# Altium schematic sheet 外围接口.SchDoc
size A4
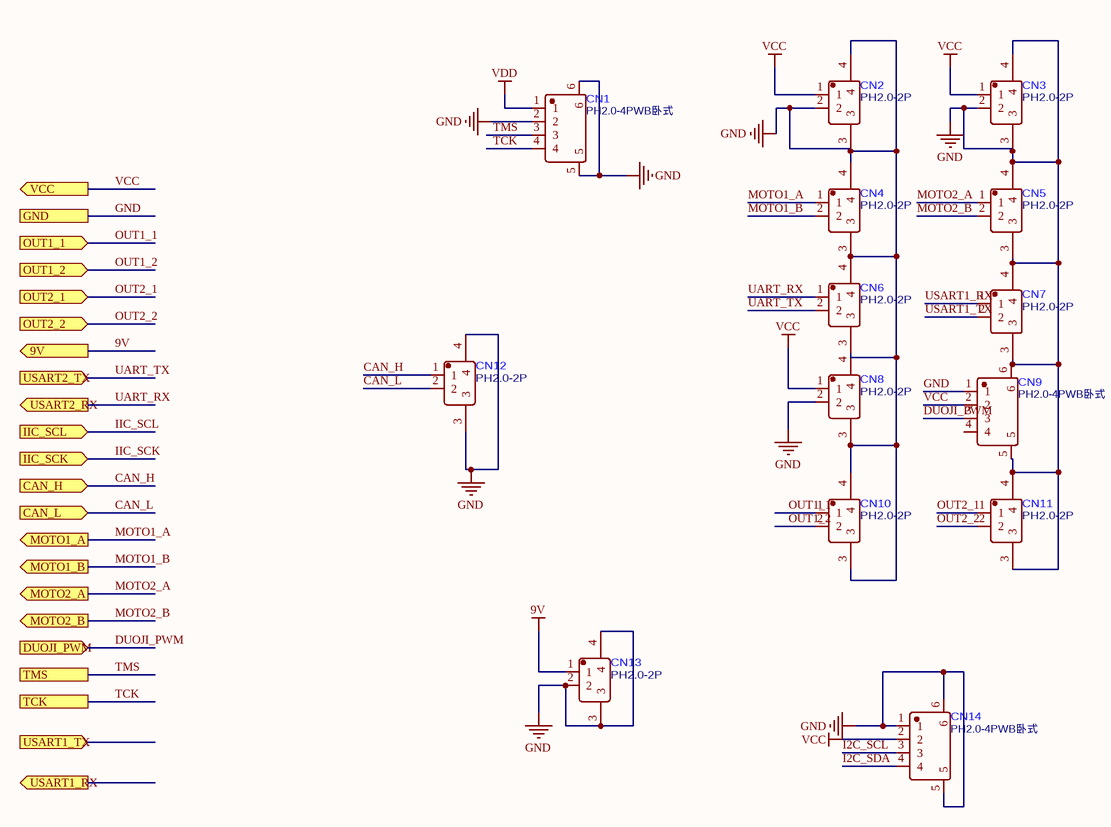
[diagram p0: 外围接口.SchDoc]

## Parts
CN1  PH2.0-4PWB卧式  [CONN-SMD_PH2.0-4PWB]
CN2  PH2.0-2P  [CONN-SMD_PH2.0-1X2PW]
CN3  PH2.0-2P  [CONN-SMD_PH2.0-1X2PW]
CN4  PH2.0-2P  [CONN-SMD_PH2.0-1X2PW]
CN5  PH2.0-2P  [CONN-SMD_PH2.0-1X2PW]
CN6  PH2.0-2P  [CONN-SMD_PH2.0-1X2PW]
CN7  PH2.0-2P  [CONN-SMD_PH2.0-1X2PW]
CN8  PH2.0-2P  [CONN-SMD_PH2.0-1X2PW]
CN9  PH2.0-4PWB卧式  [CONN-SMD_PH2.0-4PWB]
CN10  PH2.0-2P  [CONN-SMD_PH2.0-1X2PW]
CN11  PH2.0-2P  [CONN-SMD_PH2.0-1X2PW]
CN12  PH2.0-2P  [CONN-SMD_PH2.0-1X2PW]
CN13  PH2.0-2P  [CONN-SMD_PH2.0-1X2PW]
CN14  PH2.0-4PWB卧式  [CONN-SMD_PH2.0-4PWB]

## Ports
9V (out), CAN_H (in), CAN_L (in), DUOJI_PWM (in), GND, IIC_SCK (in), IIC_SCL (in), MOTO1_A (out), MOTO1_B (out), MOTO2_A (out), MOTO2_B (out), OUT1_1 (in), OUT1_2 (in), OUT2_1 (in), OUT2_2 (in), TCK, TMS, USART1_RX (out), USART1_TX (in), USART2_RX (out), USART2_TX (in), VCC (out)

## Nets
9V: CN13.1 ; port 9V
GND: CN1.2 CN1.5 CN1.6 CN2.2 CN2.3 CN2.4 CN3.2 CN3.3 CN3.4 CN4.3 CN4.4 CN5.3 CN5.4 CN6.3 CN6.4 CN7.3 CN7.4 CN8.2 CN8.3 CN9.1 CN9.5 CN9.6 CN10.3 CN10.4 CN11.3 CN11.4 CN12.3 CN12.4 CN13.2 CN13.3 CN13.4 CN14.1 CN14.5 CN14.6 ; port GND
VCC: CN2.1 CN3.1 CN8.1 CN9.2 CN14.2 ; port VCC
VDD: CN1.1
CAN_H: CN12.1 ; port CAN_H
CAN_L: CN12.2 ; port CAN_L
DUOJI_PWM: CN9.3 ; port DUOJI_PWM
I2C_SCL: CN14.3
I2C_SDA: CN14.4
IIC_SCK: port IIC_SCK
IIC_SCL: port IIC_SCL
MOTO1_A: CN4.1 ; port MOTO1_A
MOTO1_B: CN4.2 ; port MOTO1_B
MOTO2_A: CN5.1 ; port MOTO2_A
MOTO2_B: CN5.2 ; port MOTO2_B
OUT1_1: CN10.1 ; port OUT1_1
OUT1_2: CN10.2 ; port OUT1_2
OUT2_1: CN11.1 ; port OUT2_1
OUT2_2: CN11.2 ; port OUT2_2
TCK: CN1.4 ; port TCK
TMS: CN1.3 ; port TMS
UART_RX: CN6.1 ; port USART2_RX
UART_TX: CN6.2 ; port USART2_TX
USART1_RX: CN7.1
USART1_TX: CN7.2

Not connected (* = marked no-connect by the designer): CN8 4; CN9 4